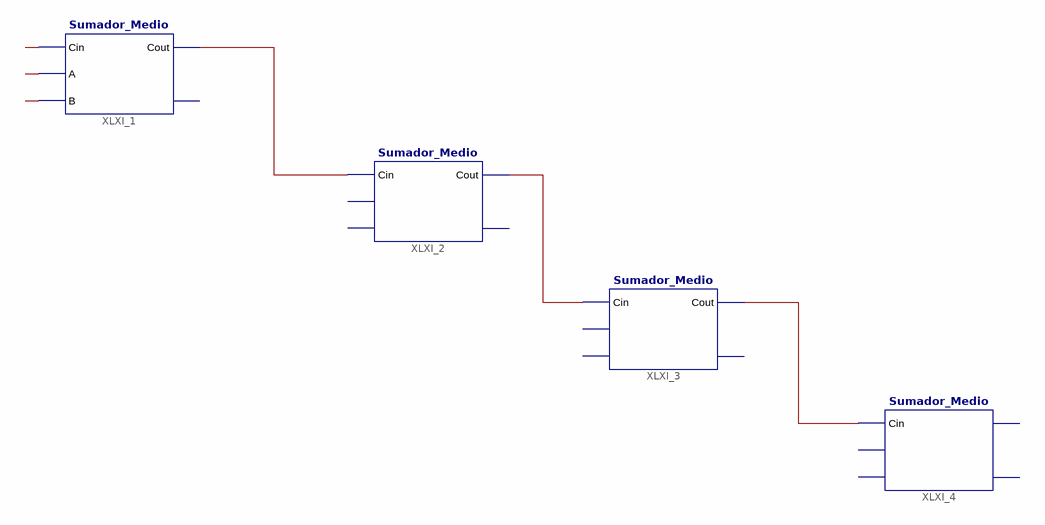
[diagram p0: schematic sheet 1]
// Xilinx ISE schematic Sumador_Cuatro_bits.sch (virtex5) as structural Verilog: 4 symbols, 0 ports
module Sumador_Cuatro_bits (
);

  wire XLXN_1, XLXN_2, XLXN_3, XLXN_4, XLXN_5, XLXN_6;

  Sumador_Medio XLXI_1 (.Cin(XLXN_4), .A(XLXN_5), .B(XLXN_6), .Cout(XLXN_1));  // open: S
  Sumador_Medio XLXI_2 (.Cin(XLXN_1), .Cout(XLXN_2));  // open: A, B, S
  Sumador_Medio XLXI_3 (.Cin(XLXN_2), .Cout(XLXN_3));  // open: A, B, S
  Sumador_Medio XLXI_4 (.Cin(XLXN_3));  // open: A, B, Cout, S
endmodule
